# Altium schematic sheet FPGA_U1_Manual.SchDoc
size B
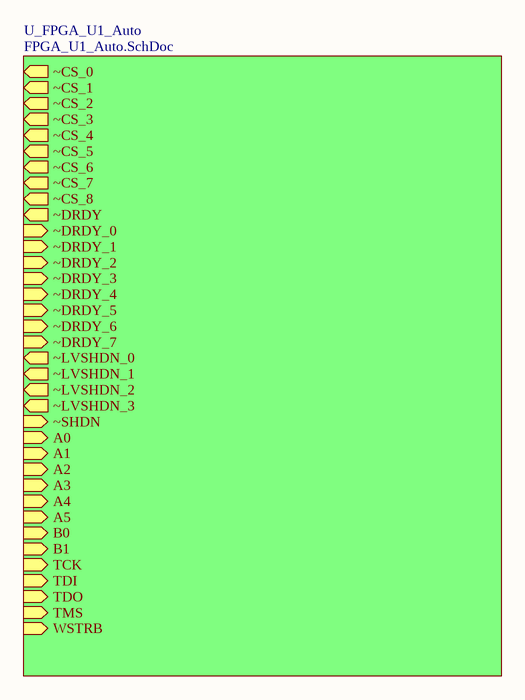
[diagram p0: FPGA_U1_Manual.SchDoc]

## Sub-sheets
U_FPGA_U1_Auto = FPGA_U1_Auto.SchDoc: ~CS_0 (out), ~CS_1 (out), ~CS_2 (out), ~CS_3 (out), ~CS_4 (out), ~CS_5 (out), ~CS_6 (out), ~CS_7 (out), ~CS_8 (out), ~DRDY (out), ~DRDY_0 (in), ~DRDY_1 (in), ~DRDY_2 (in), ~DRDY_3 (in), ~DRDY_4 (in), ~DRDY_5 (in), ~DRDY_6 (in), ~DRDY_7 (in), ~LVSHDN_0 (out), ~LVSHDN_1 (out), ~LVSHDN_2 (out), ~LVSHDN_3 (out), ~SHDN (in), A0 (in), A1 (in), A2 (in), A3 (in), A4 (in), A5 (in), B0 (in), B1 (in), TCK (in), TDI (in), TDO (in), TMS (in), WSTRB (in)